# EAGLE design fates-shield-v0.3 (EAGLE 9.6.2)

## Sheet 1 of 2
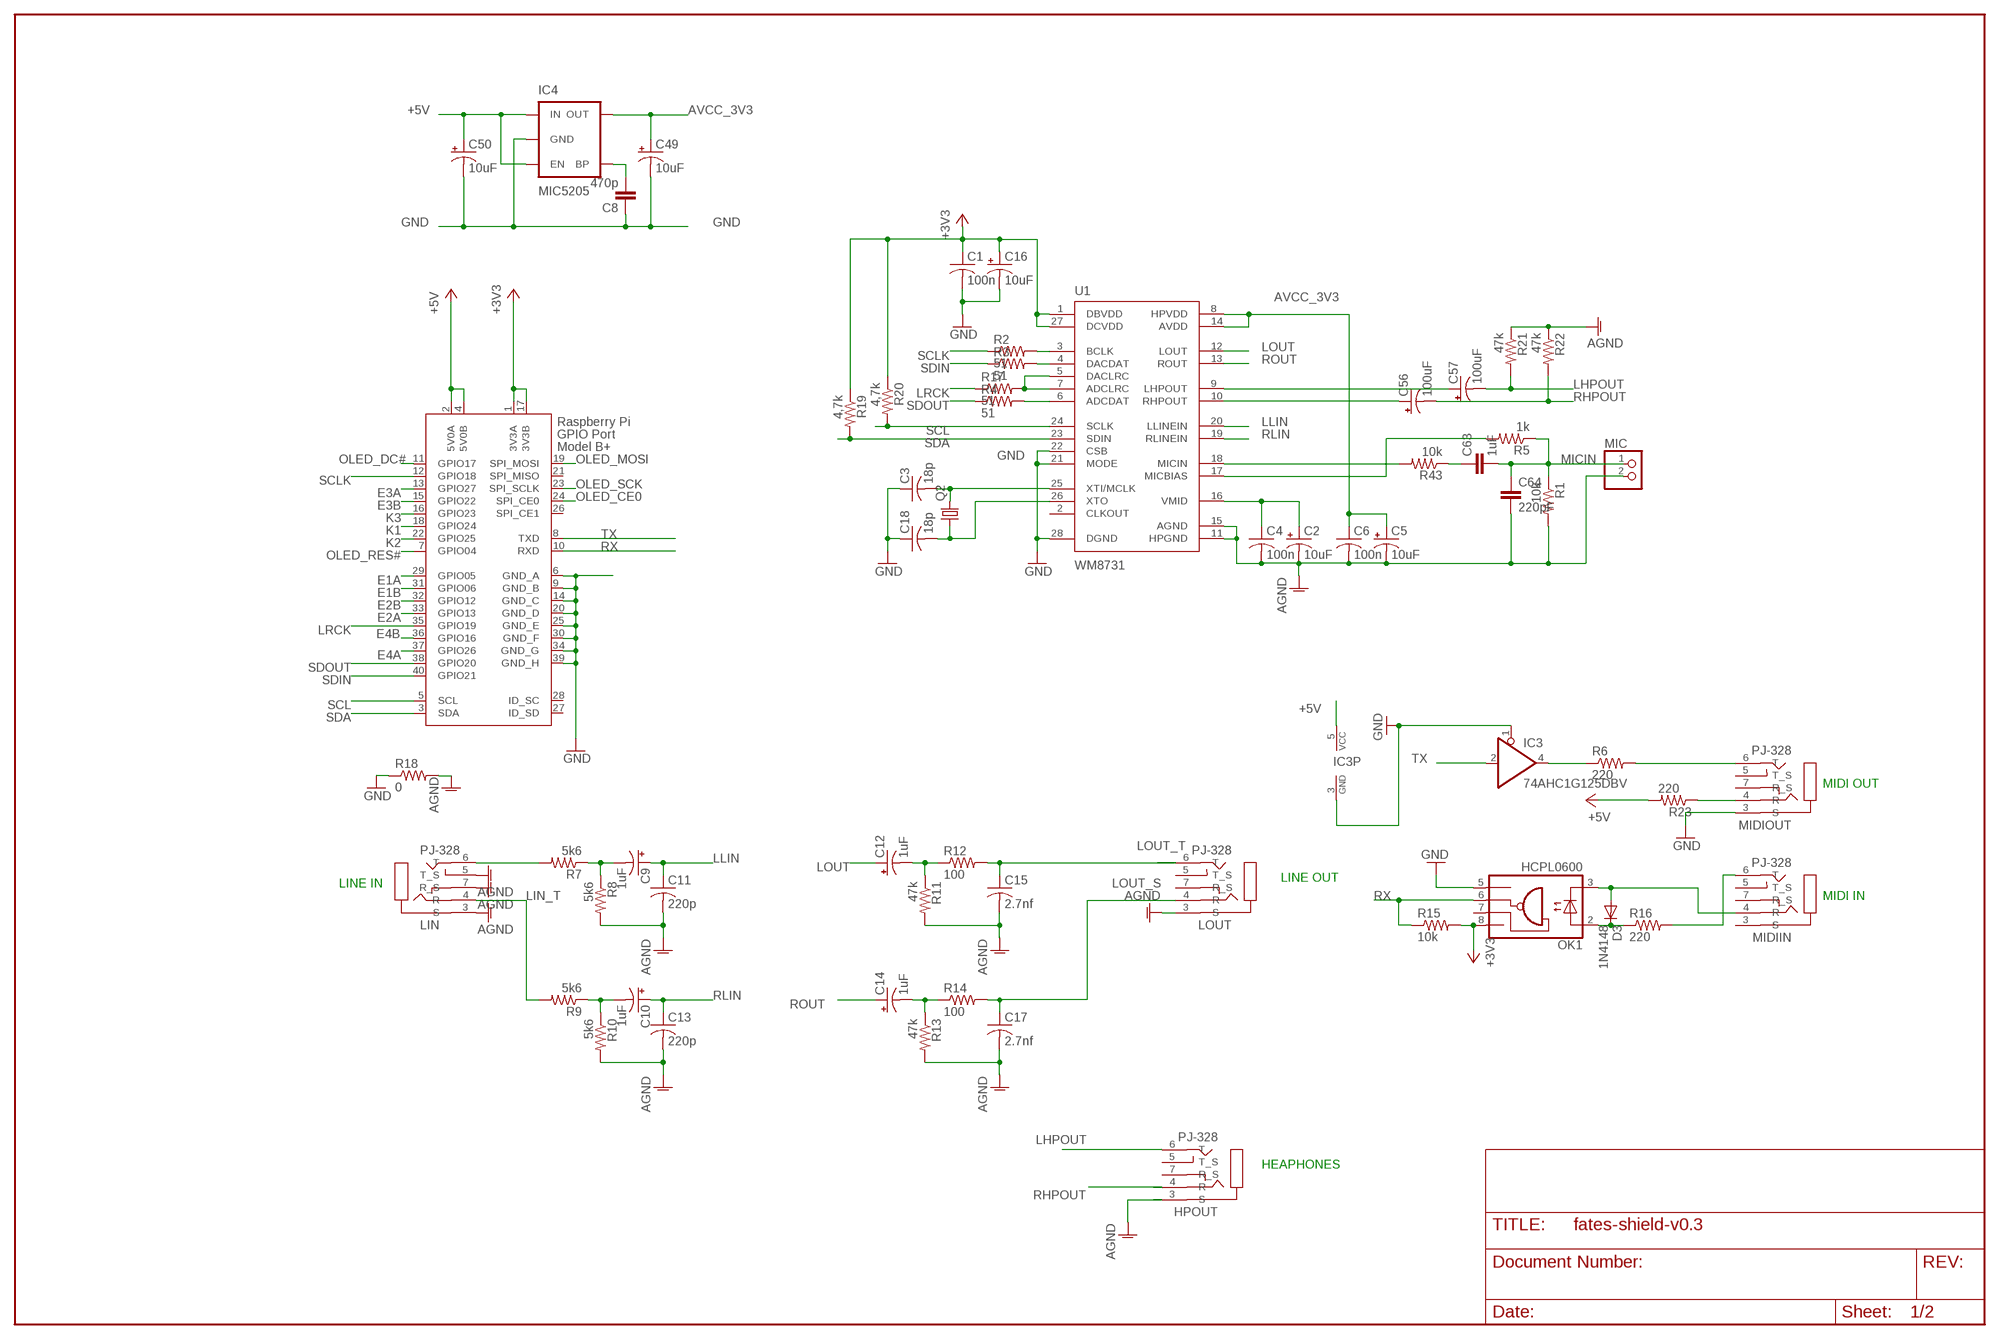
[diagram p0: schematic, sheet 1]

### Parts
C1  100n  C-USC0603  [C0603]
C2  10uF  CAP_POL1206  [EIA3216]
C3  18p  C-USC0603  [C0603]
C4  100n  C-USC0603  [C0603]
C5  10uF  CAP_POL1206  [EIA3216]
C6  100n  C-USC0603  [C0603]
C8  470p  CAP0603-CAP  [0603-CAP]
C9  1uF  CAP_POL1206  [EIA3216]
C10  1uF  CAP_POL1206  [EIA3216]
C11  220p  C-USC0603  [C0603]
C12  1uF  CAP_POL1206  [EIA3216]
C13  220p  C-USC0603  [C0603]
C14  1uF  CAP_POL1206  [EIA3216]
C15  2.7nf  C-USC0603  [C0603]
C16  10uF  CAP_POL1206  [EIA3216]
C17  2.7nf  C-USC0603  [C0603]
C18  18p  C-USC0603  [C0603]
C49  10uF  CAP_POL1206  [EIA3216]
C50  10uF  CAP_POL1206  [EIA3216]
C56  100uF  CAP_POL3528  [EIA3528]
C57  100uF  CAP_POL3528  [EIA3528]
C63  1uF  CAP0603-CAP  [0603-CAP]
C64  220pF  CAP0603-CAP  [0603-CAP]
D3  1N4148  DIODE-SOD323-W  [SOD323-W]
HPOUT  PJ-328  [PJ328]
IC3  74AHC1G125DBV  [DBV_R-PDSO-G5]
IC4  MIC5205  V_REG_LDOSMD  [SPARKFUN-3-2-07_SOT23-5]
LIN  PJ-328  [PJ328]
LOUT  PJ-328  [PJ328]
MIC  PINHD-1X2  [1X02]
MIDIIN  PJ-328  [PJ328]
MIDIOUT  PJ-328  [PJ328]
OK1  HCPL0600  [SOIC08]
Q2  CRYSTALHC49UP  [HC49UP]
R1  10k  RESISTOR0603-RES  [0603-RES]
R2  51  R-US_R0603  [R0603]
R3  51  R-US_R0603  [R0603]
R4  51  R-US_R0603  [R0603]
R5  1k  RESISTOR0603-RES  [0603-RES]
R6  220  R-US_R0603  [R0603]
R7  5k6  R-US_R0603  [R0603]
R8  5k6  R-US_R0603  [R0603]
R9  5k6  R-US_R0603  [R0603]
R10  5k6  R-US_R0603  [R0603]
R11  47k  R-US_R0603  [R0603]
R12  100  R-US_R0603  [R0603]
R13  47k  R-US_R0603  [R0603]
R14  100  R-US_R0603  [R0603]
R15  10k  R-US_R0603  [R0603]
R16  220  R-US_R0603  [R0603]
R17  51  R-US_R0603  [R0603]
R18  0  R-US_R0603  [R0603]
R19  4,7k  RESISTOR0603-RES  [0603-RES]
R20  4,7k  RESISTOR0603-RES  [0603-RES]
R21  47k  RESISTOR0603-RES  [0603-RES]
R22  47k  RESISTOR0603-RES  [0603-RES]
R23  220  R-US_R0603  [R0603]
R43  10k  RESISTOR0603-RES  [0603-RES]
U1  WM8731  [SSOP28]
X1  RASPI_BOARD_B+#_E3  [RASPI_BOARD_B+_EDGES_3DRILL]

### Nets
+3V3: C1.1 C16.A(+) OK1.8(VCC) R15.2 R19.1 R20.1 U1.1(DBVDD) U1.27(DCVDD) X1.1(3V3A) X1.17(3V3B) ; also sheet 2
+5V: C50.A(+) IC3.5(VCC) IC4.1(IN) IC4.3(EN) R23.2 X1.2(5V0A) X1.4(5V0B)
ADCDAT: R4.2 U1.6(ADCDAT)
ADCLRC: R17.2 U1.5(DACLRC) U1.7(ADCLRC)
AGND: C2.C(-) C4.2 C5.C(-) C6.2 C11.2 C13.2 C15.2 C17.2 C64.2 HPOUT.3(S) LIN.3(S) LIN.5(T_S) LIN.7(R_S) LOUT.3(S) MIC.2 R1.2 R8.2 R10.2 R11.2 R13.2 R18.2 R21.1 R22.1 U1.11(HPGND) U1.15(AGND)
AVCC_3V3 [power]: C5.A(+) C6.1 C49.A(+) IC4.5(OUT) U1.8(HPVDD) U1.14(AVDD)
BCLK: R2.2 U1.3(BCLK)
DACDAT: R3.2 U1.4(DACDAT)
E1A: X1.29(GPIO05) ; also sheet 2
E1B: X1.31(GPIO06) ; also sheet 2
E2A: X1.33(GPIO13) ; also sheet 2
E2B: X1.32(GPIO12) ; also sheet 2
E3A: X1.13(GPIO27) ; also sheet 2
E3B: X1.15(GPIO22) ; also sheet 2
E4A: X1.37(GPIO26) ; also sheet 2
E4B: X1.36(GPIO16) ; also sheet 2
GND: C1.2 C3.1 C8.1 C16.C(-) C18.1 C49.C(-) C50.C(-) IC3.1(OE) IC3.3(GND) IC4.2(GND) MIDIOUT.3(S) OK1.5(GND) R18.1 U1.21(MODE) U1.22(CSB) U1.28(DGND) X1.6(GND_A) X1.9(GND_B) X1.14(GND_C) X1.20(GND_D) X1.25(GND_E) X1.30(GND_F) X1.34(GND_G) X1.39(GND_H) ; also sheet 2
K1: X1.18(GPIO24) ; also sheet 2
K2: X1.22(GPIO25) ; also sheet 2
K3: X1.16(GPIO23) ; also sheet 2
L_HPOUT: C57.A(+) U1.9(LHPOUT)
LHPOUT: C57.C(-) HPOUT.6(T) R21.2
LIN_T: LIN.4(R) R9.2
LLIN: C9.A(+) C11.1 U1.20(LLINEIN)
LOUT: C12.A(+) U1.12(LOUT)
LOUT_S: C17.1 LOUT.4(R) R14.2
LOUT_T: C15.1 LOUT.6(T) R12.2
LRCK: R17.1 X1.35(GPIO19)
MIC_BIAS: R5.2 U1.17(MICBIAS)
MIC_IN: R43.2 U1.18(MICIN)
MICIN: C63.2 C64.1 MIC.1 R1.1 R5.1
N$2: MIDIOUT.4(R) R23.1
N$3: IC3.4(O) R6.1
N$4: C2.A(+) C4.1 U1.16(VMID)
N$9: C9.C(-) R7.1 R8.1
N$10: C10.C(-) R9.1 R10.1
N$13: C14.C(-) R13.1 R14.1
N$14: C12.C(-) R11.1 R12.1
N$16: LIN.6(T) R7.2
N$20: D3.A MIDIIN.4(R) OK1.3(C)
N$21: D3.C OK1.2(A) R16.1
N$23: MIDIIN.6(T) R16.2
N$24: MIDIOUT.6(T) R6.2
N$38: C8.2 IC4.4(BP)
N$54: C63.1 R43.1
OLED_CE0: X1.24(SPI_CE0) ; also sheet 2
OLED_DC#: X1.11(GPIO17) ; also sheet 2
OLED_MOSI: X1.19(SPI_MOSI) ; also sheet 2
OLED_RES#: X1.7(GPIO04) ; also sheet 2
OLED_SCK: X1.23(SPI_SCLK) ; also sheet 2
R_HPOUT: C56.A(+) U1.10(RHPOUT)
RHPOUT: C56.C(-) HPOUT.4(R) R22.2
RLIN: C10.A(+) C13.1 U1.19(RLINEIN)
ROUT: C14.A(+) U1.13(ROUT)
RX: OK1.6(VO) R15.1 X1.10(RXD)
SCL: R20.2 U1.24(SCLK) X1.5(SCL)
SCLK: R2.1 X1.12(GPIO18)
SDA: R19.2 U1.23(SDIN) X1.3(SDA)
SDIN: R3.1 X1.40(GPIO21)
SDOUT: R4.1 X1.38(GPIO20)
TX: IC3.2(I) X1.8(TXD)
XTI: C3.2 Q2.2 U1.25(XTI/MCLK)
XTO: C18.2 Q2.1 U1.26(XTO)
Unconnected: HPOUT.5(T_S) HPOUT.7(R_S) LOUT.5(T_S) LOUT.7(R_S) MIDIIN.3(S) MIDIIN.5(T_S) MIDIIN.7(R_S) MIDIOUT.5(T_S) MIDIOUT.7(R_S) OK1.7(VE) U1.2(CLKOUT) X1.21(SPI_MISO) X1.26(SPI_CE1) X1.27(ID_SD) X1.28(ID_SC)

### Notes on the sheet
- MIDI OUT
- LINE OUT
- LINE IN
- MIDI IN
- HEAPHONES

## Sheet 2 of 2
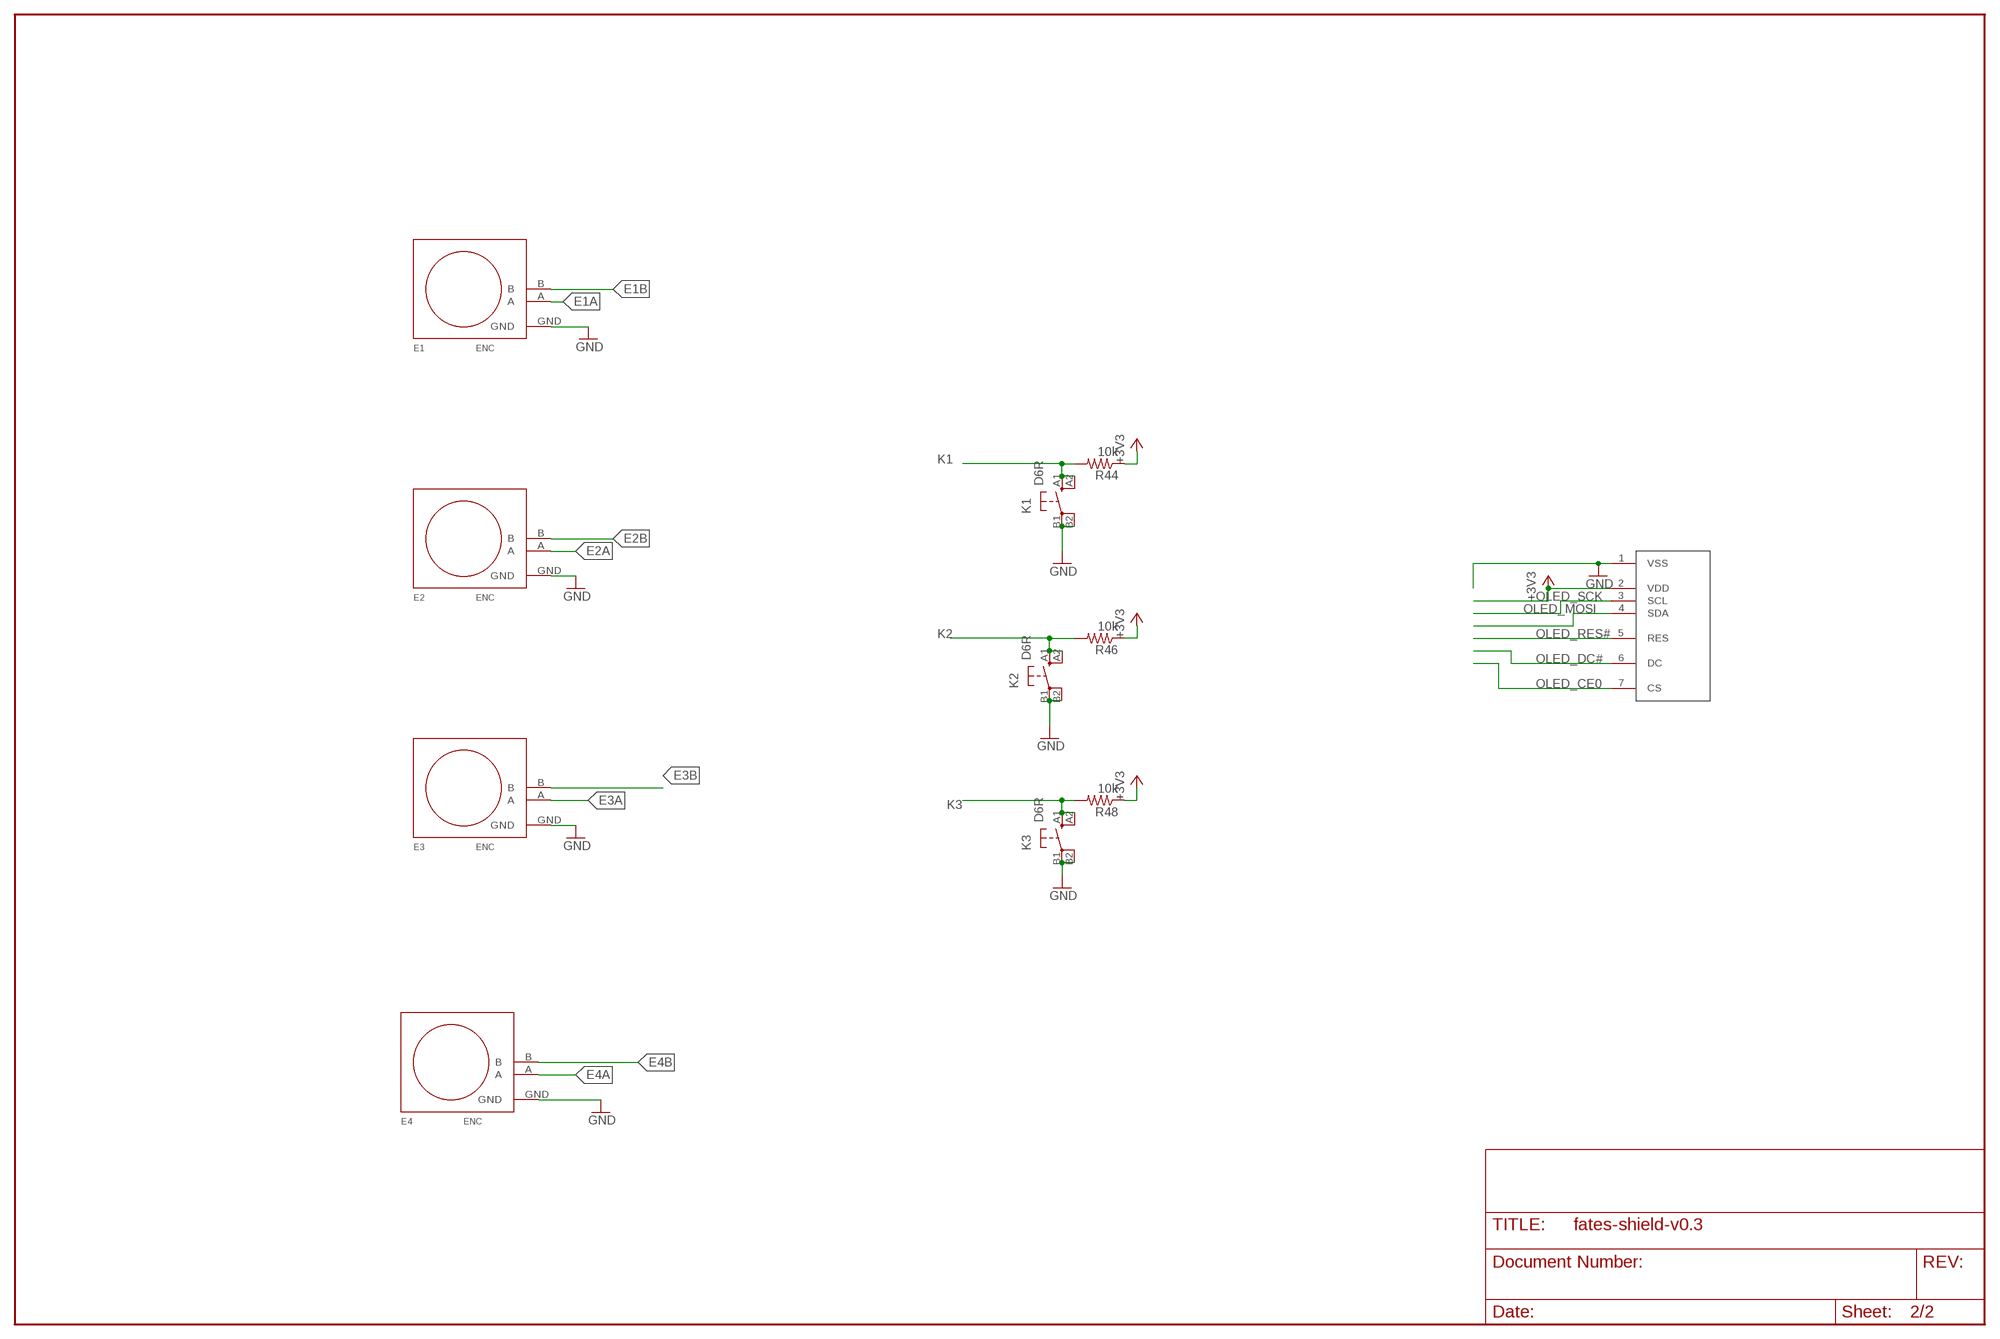
[diagram p1: schematic, sheet 2]

### Parts
E1  ENC  [PEC11RN]
E2  ENC  [PEC11RN]
E3  ENC  [PEC11RN]
E4  ENC  [PEC11RN]
K1  D6R  [D6R]
K2  D6R  [D6R]
K3  D6R  [D6R]
R44  10k  R-US_R0603  [R0603]
R46  10k  R-US_R0603  [R0603]
R48  10k  R-US_R0603  [R0603]
U$2  OLED128X64SSD1325  [OLED-SSD1325]

### Nets
+3V3: R44.1 R46.1 R48.1 U$2.2(VDD) ; also sheet 1
E1A: E1.A ; also sheet 1
E1B: E1.B ; also sheet 1
E2A: E2.A ; also sheet 1
E2B: E2.B ; also sheet 1
E3A: E3.A ; also sheet 1
E3B: E3.B ; also sheet 1
E4A: E4.A ; also sheet 1
E4B: E4.B ; also sheet 1
GND: E1.GND E2.GND E3.GND E4.GND K1.B1(P) K1.B2(P1) K2.B1(P) K2.B2(P1) K3.B1(P) K3.B2(P1) U$2.1(VSS) ; also sheet 1
K1: K1.A1(S) K1.A2(S1) R44.2 ; also sheet 1
K2: K2.A1(S) K2.A2(S1) R46.2 ; also sheet 1
K3: K3.A1(S) K3.A2(S1) R48.2 ; also sheet 1
OLED_CE0: U$2.7(CS) ; also sheet 1
OLED_DC#: U$2.6(DC) ; also sheet 1
OLED_MOSI: U$2.4(SDA) ; also sheet 1
OLED_RES#: U$2.5(RES) ; also sheet 1
OLED_SCK: U$2.3(SCL) ; also sheet 1

## Library data of the parts
C1 C3 C4 C6 C11 C13 C15 C17 C18 = rcl:C-US: CAPACITOR, American symbol
C2 C5 C9 C10 C12 C14 C16 C49 C50 = osborn:CAP_POL: Capacitor Polarized These are standard SMD and PTH capacitors. Normally 10uF, 47uF, and 100uF in electrolytic and tantalum varieties. Always verify the external diameter of the through hole cap, it varies with capacity, voltage, and manufacturer. The EIA devices should be standard.; CID: 340
C8 = osborn:CAP: Capacitor Standard 0603 ceramic capacitor, and 0.1" leaded capacitor.; CID: 111
C56 C57 = SparkFun-20110623:CAP_POL: Capacitor Polarized These are standard SMD and PTH capacitors. Normally 10uF, 47uF, and 100uF in electrolytic and tantalum varieties. Always verify the external diameter of the through hole cap, it varies with capacity, voltage, and manufacturer. The EIA devices should be standard.; CID: 68
C63 = osborn:CAP: Capacitor Standard 0603 ceramic capacitor, and 0.1" leaded capacitor.; CID: 73
C64 = osborn:CAP: Capacitor Standard 0603 ceramic capacitor, and 0.1" leaded capacitor.; CID: 345
D3 = diode:DIODE-: DIODE
E1-E4 = lines:ENC
HPOUT LIN LOUT MIDIIN MIDIOUT = PJ-328:PJ-328: 2.5/3.5 Phone jack series Source: Datasheet <http://www.intechswitch.com/products/2535Phonejackseries2535chazuoxilie/202.html>; DESCRIPTION: 2.5/3.5 Phone jack series; HEIGHT: 5mm; MANUFACTURER_NAME: Intech Electronic Technology; MANUFACTURER_PART_NUMBER: PJ-328
IC3 = 74xx-little-de:74*1G125: Single Bus Buffer Gate with 3-State Output
IC4 = osborn:V_REG_LDO: Voltage Regulator LDO Standard 150mA LDO voltage regulator in SOT-23 layout. Micrel part MIC5205. BP (by-pass) pin is used to lower output noise with 470pF cap.; CID: 146
K1-K3 = og-switch:D6R: C&K D6R
MIC = pinhead:PINHD-1X2: PIN HEADER
OK1 = HCPL0600:HCPL0600: HEWLETT PACKARD OPTO COUPLER Check prices <https://pricing.snapeda.com/parts/HCPL0600/ON%20Semiconductor/view-part?ref=eda>; AVAILABILITY: In Stock; DESCRIPTION: Logic Output Optoisolator 10Mbps Open Collector 3750Vrms 1 Channel 5kV/µs CMTI 8-SOIC; MF: ON Semiconductor; MP: HCPL0600; PACKAGE: SOIC-8 ON Semiconductor; PRICE: None; PURCHASE-URL: https://pricing.snapeda.com/search/part/HCPL0600/?ref=eda
Q2 = crystal:CRYSTAL: CRYSTAL
R1 R43 = osborn:RESISTOR: Resistor Basic schematic elements and footprints for 0603, 1206, and PTH resistors.; CID: 69; SUPPLIER: none
R2-R4 R6-R18 R23 R44 R46 R48 = rcl:R-US_: RESISTOR, American symbol
R5 = osborn:RESISTOR: Resistor Basic schematic elements and footprints for 0603, 1206, and PTH resistors.; CID: 102; SUPPLIER: none
R19-R22 = osborn:RESISTOR: Resistor Basic schematic elements and footprints for 0603, 1206, and PTH resistors.; CID: 236; SUPPLIER: none
U1 = og-dac:WM8731
U$2 = oled-modules:OLED128X64: SSD1325 7-pin SPi OLED
X1 = raspberrypi_bastelstube_v13:RASPI_BOARD_B+#: Raspberry Pi GPIO connector with markings for the outer dimensions of the Raspberry Pi board model B+ with different sets of drill holes or mounting pads All pins connected

## Net classes
1 power: width 0.508 mm

## Board
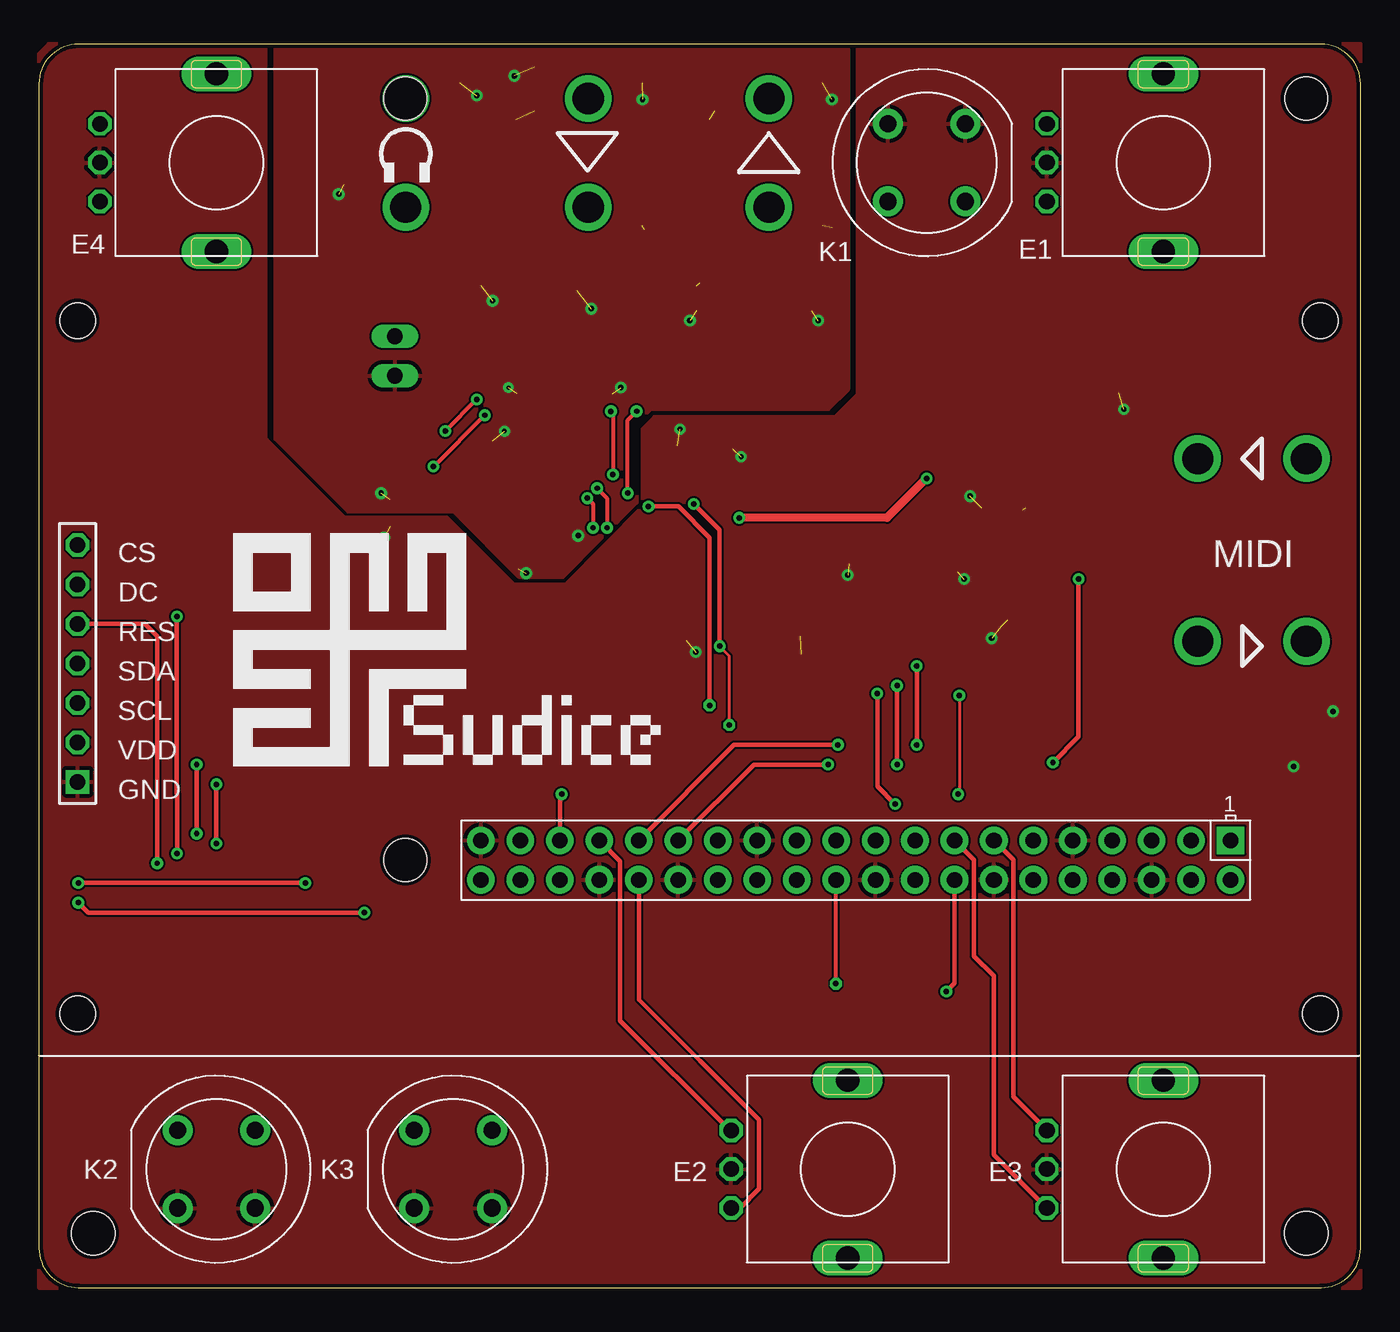
[diagram p2: board, top side]
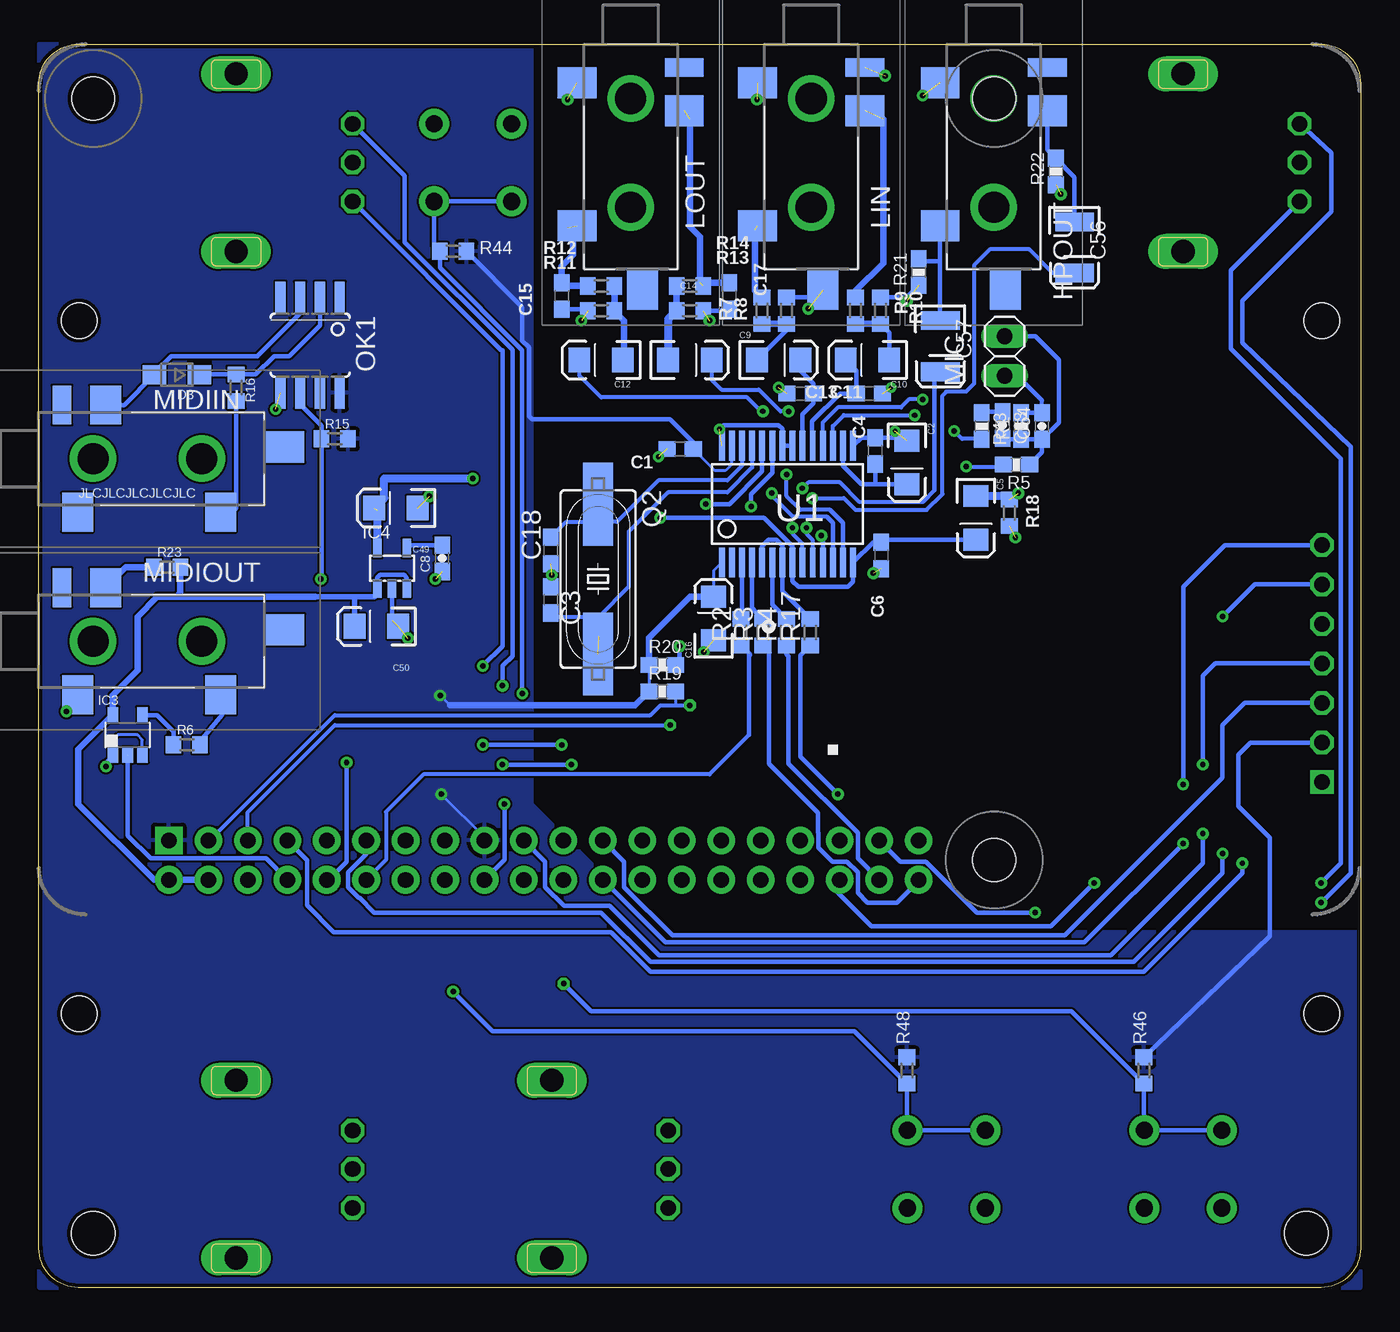
[diagram p3: board, bottom side, seen from below]

Size 85.09 x 80.01 mm. Coordinates in mm from the lower left corner, seen from the top.
Outline: 0,77.47 0,2.54 arc90 2.54,0 82.55,0 arc90 85.09,2.54 85.09,77.47 arc90 82.55,80.01 2.54,80.01 arc90 0,77.47
Copper layers (1*16): Top 0.035mm / dielectric 1.5mm / Bottom 0.035mm
Design rules "default *": minimum track width 8mil, minimum drill 10mil, track to track 5mil, track to pad 5mil, pad to pad 5mil, via to via 5mil, smd to smd 0mil, copper to edge 10mil, drill to drill 8mil, minimum pad ring 10mil, minimum via ring 8mil, stop-mask expansion 4mil, vias tented up to drill 0mil, thermal gap 10mil
Holes 2.8 mm at 81.6,3.49 3.49,3.49

### Footprints (pad centres in the part's own frame; a part is rotated, then mirrored left to right if it is on the bottom)
C0603 = smd 1.1 x 1: 1 -0.85,0; 2 0.85,0
EIA3216 = smd 1.4 x 1.6: A 1.4,0; C -1.4,0
0603-CAP = smd 1.1 x 1: 1 -0.85,0; 2 0.85,0
EIA3528 = smd 1.2 x 2.5: A 1.65,0; C -1.65,0
SOD323-W = smd 1.5 x 1.2: A 1.45,0; C -1.45,0
PEC11RN = drill 1 octagon: A -2.5,-7.5; B 2.5,-7.5; GND 0,-7.5 | drill 1.5 long: P$1 -5.715,0; P$2 5.715,0
PJ328 = smd 2 x 2.5: 3 -4.175,-3.45; 4 -2.375,3.45; 6 5.025,-3.45 | smd 2.5 x 2: 5 9.175,0.75 | smd 1.2 x 2.5: 7 -5.175,3.45 | drill 2 pad 3: MH1 -3.175,0; MH2 3.825,0
DBV_R-PDSO-G5 = smd 0.69 x 0.99: 1 -0.95,-1.29; 2 0,-1.29; 3 0.95,-1.29; 4 0.95,1.3; 5 -0.95,1.3
SPARKFUN-3-2-07_SOT23-5 = smd 0.55 x 1.2: 1 -0.95,-1.3; 2 0,-1.3; 3 0.95,-1.3; 4 0.95,1.3; 5 -0.95,1.3
D6R = drill 1.1 pad 1.93: A1 -2.5,2.5; A2 2.5,2.5; B1 -2.5,-2.5; B2 2.5,-2.5
1X02 = drill 1.016 long: 1 -1.27,0; 2 1.27,0
SOIC08 = smd 0.66 x 2.032: 1 -1.905,-3.073; 2 -0.635,-3.073; 3 0.635,-3.073; 4 1.905,-3.073; 5 1.905,3.073; 6 0.635,3.073; 7 -0.635,3.073; 8 -1.905,3.073
HC49UP = smd 5.334 x 1.93: 1 -4.826,0; 2 4.826,0
0603-RES = smd 1.1 x 1: 1 -0.85,0; 2 0.85,0
R0603 = smd 1 x 1.1: 1 -0.85,0; 2 0.85,0
SSOP28 = smd 0.381 x 1.905: 1 -4.55,-3.752; 2 -3.9,-3.752; 3 -3.25,-3.752; 4 -2.6,-3.752; 5 -1.95,-3.752; 6 -1.3,-3.752; 7 -0.65,-3.752; 8 0,-3.752; 9 0.65,-3.752; 10 1.3,-3.752; 11 1.95,-3.752; 12 2.6,-3.752; 13 3.25,-3.752; 14 3.9,-3.752; 15 3.9,3.752; 16 3.25,3.752; 17 2.6,3.752; 18 1.95,3.752; 19 1.3,3.752; 20 0.65,3.752; 21 0,3.752; 22 -0.65,3.752; 23 -1.3,3.752; 24 -1.95,3.752; 25 -2.6,3.752; 26 -3.25,3.752; 27 -3.9,3.752; 28 -4.55,3.752
OLED-SSD1325 = drill 1 pad 1.5 square: 1 2.499,17.62 | drill 1 pad 1.5 octagon: 2 2.499,20.16; 3 2.499,22.7; 4 2.499,25.24; 5 2.499,27.78; 6 2.499,30.32; 7 2.499,32.86 | hole 2.286: 82.5,2.7; 2.5,2.7; 82.5,47.3; 2.5,47.3
RASPI_BOARD_B+_EDGES_3DRILL = drill 1 pad 1.778 square: 1 8.37,51.23 | drill 1 pad 1.778: 2 8.37,53.77; 3 10.91,51.23; 4 10.91,53.77; 5 13.45,51.23; 6 13.45,53.77; 7 15.99,51.23; 8 15.99,53.77; 9 18.53,51.23; 10 18.53,53.77; 11 21.07,51.23; 12 21.07,53.77; 13 23.61,51.23; 14 23.61,53.77; 15 26.15,51.23; 16 26.15,53.77; 17 28.69,51.23; 18 28.69,53.77; 19 31.23,51.23; 20 31.23,53.77; 21 33.77,51.23; 22 33.77,53.77; 23 36.31,51.23; 24 36.31,53.77; 25 38.85,51.23; 26 38.85,53.77; 27 41.39,51.23; 28 41.39,53.77; 29 43.93,51.23; 30 43.93,53.77; 31 46.47,51.23; 32 46.47,53.77; 33 49.01,51.23; 34 49.01,53.77; 35 51.55,51.23; 36 51.55,53.77; 37 54.09,51.23; 38 54.09,53.77; 39 56.63,51.23; 40 56.63,53.77 | hole 2.75: 3.5,3.5; 61.5,3.5; 61.5,52.5

### Placement (x,y rotation side)
C1  43.81,53.97 180 bottom
C2  29.21,53.09 270 bottom
C3  52.13,44.26 270 bottom
C4  31.24,53.85 90 bottom
C5  24.77,49.53 270 bottom
C6  30.86,47.12 270 bottom
C8  59.12,46.93 90 bottom
C9  37.47,59.69 0 bottom
C10  31.75,59.69 180 bottom
C11  36.07,57.53 180 bottom
C12  48.9,59.69 180 bottom
C13  31.62,57.53 0 bottom
C14  43.18,59.69 0 bottom
C15  51.44,63.82 270 bottom
C16  41.66,43.05 90 bottom
C17  40.64,63.82 270 bottom
C18  52.13,47.43 90 bottom
C49  62.1,50.16 180 bottom
C50  63.37,42.55 180 bottom
C56  18.41,66.93 270 bottom
C57  27.05,60.58 270 bottom
C63  23.05,55.5 270 bottom
C64  20.51,55.44 90 bottom
D3  76.2,58.74 180 bottom
E1  72.39,72.39 270 top
E2  52.07,7.62 270 top
E3  72.39,7.62 270 top
E4  11.43,72.39 270 top
HPOUT  23.62,73.34 270 bottom
IC3  79.38,35.56 0 bottom
IC4  62.36,46.29 0 bottom
K1  57.15,72.39 180 top
K2  11.43,7.62 0 top
K3  26.67,7.62 0 top
LIN  35.37,73.34 270 bottom
LOUT  46.99,73.34 270 bottom
MIC  22.92,59.94 270 bottom
MIDIIN  78.42,53.34 0 bottom
MIDIOUT  78.42,41.59 0 bottom
OK1  67.63,60.64 180 bottom
Q2  49.09,45.59 270 bottom
R1  21.84,55.44 90 bottom
R2  39.88,42.16 90 bottom
R3  38.48,42.16 90 bottom
R4  36.96,42.16 90 bottom
R5  22.16,52.96 180 bottom
R6  75.56,34.92 0 bottom
R7  38.54,62.86 90 bottom
R8  36.96,62.86 90 bottom
R9  32.51,62.86 90 bottom
R10  30.92,62.86 90 bottom
R11  48.9,62.86 180 bottom
R12  48.9,64.45 180 bottom
R13  43.18,62.86 0 bottom
R14  43.18,64.45 0 bottom
R15  66.04,54.61 0 bottom
R16  72.39,57.91 270 bottom
R17  35.43,42.16 90 bottom
R18  22.61,49.85 90 bottom
R19  44.96,38.35 0 bottom
R20  44.96,40.07 0 bottom
R21  28.45,65.34 90 bottom
R22  19.62,71.82 90 bottom
R23  76.83,46.36 0 bottom
R43  24.38,55.44 270 bottom
R44  58.42,66.67 180 bottom
R46  13.97,13.97 270 bottom
R48  29.21,13.97 270 bottom
U1  36.58,50.42 0 bottom
U$2  0,14.92 0 top
X1  85.09,80.01 180 top

### Tracks (layer width: path | path; a pad name or v marks a point on that pad's centre or on a via)
+3V3  (via drill 0.35)
  Top 0.203: v59.25,38.1 59.25,31.82 v59.18,31.75
  Bottom 0.203: U1.27 40.51,54.13 40.51,52.96 40.89,52.58 41.57,52.58 C1.1 | U1.1 41.66,46.14 C16.A | R20.1 45.81,40 R19.1 | 58.61,37.47 59,37.86 59,38.05 59.05,38.1 v59.25,38.1 | v59.18,31.75 56.4,28.97 X1.17
  Bottom 0.305: R46.1 5.84,22.61 5.84,28.96 7.87,30.99 7.87,34.29 7.11,35.05 2.53,35.05 U$2.2 | C1.1 42.97,54.39 44.45,55.88 53.34,55.88 53.54,56.08 53.54,60.5 53.98,60.94 53.98,63.08 R44.1
  Bottom 0.406: R19.1 46.7,37.47 58.61,37.47 | C16.A 43.18,44.45 45.81,41.82 45.81,40
  pour Bottom: 0,22.86 45.09,22.86 53.34,31.11 53.34,80.01 85.09,80.01 85.09,0 0,0
+5V
  Bottom 0.305: IC4.3 61.41,45.69 61.59,45.87 63.13,45.87 63.31,45.69 IC4.1
  Bottom 0.356: 64.77,44.45 63.5,44.45 63.31,44.64 IC4.1 | C50.A 64.77,44.45 | 67.31,44.45 64.77,44.45
  Bottom 0.406: X1.4 X1.2 77.67,26.24 82.55,31.11 82.55,34.63 IC3.5 80.33,38.13 78.74,39.72 78.74,43.18 77.47,44.45 76.2,44.45 | 76.2,44.45 67.31,44.45 | R23.2 75.98,44.66 76.2,44.45
ADCDAT
  Bottom 0.305: U1.6 37.88,43.93 R4.2
ADCLRC
  Bottom 0.305: R17.2 37.23,44.81 U1.7 37.23,47.74 37.61,48.12 38.12,48.12 38.53,47.71 U1.5
AGND  (via drill 0.25 pad 0.38, 0.3, 0.35, 0.35 pad 0.38)  (14 unrouted)
  Top 0.254: 22.1,58.67 MIC.2
  Bottom 0.254: C64.2 20.51,57.09
  Bottom 0.305: C64.2 R1.2 | R8.2 35.07,63.72 LIN.5 | R13.2 40.74,62.86 C17.2 | C15.2 49.85,62.97 R11.2 | R10.2 29.22,63.72 R21.1 | C2.C 29.42,54.7 C4.2 32.15,54.7 U1.15 | U1.11 34.63,48.3 v34.71,48.39 | 20.51,57.09 22.1,58.67 MIC.2
  Bottom 0.508: R18.2 22.84,50.93 C5.C
  other vias: 30.61,77.98 38.86,76.45 51.05,76.45 28.19,76.71 19.3,70.36 22.03,51.12 35.56,62.99 50.16,62.23 41.91,62.23 29.21,63.5 30.23,57.91 37.47,57.91 31.37,45.97 29.97,55.12
  pour Top: 52.07,80.01 52.07,57.78 50.8,56.52 39.37,56.52 38.48,55.63 38.48,50.53 33.72,45.72 30.92,45.72 26.73,49.91 19.94,49.91 15.24,54.61 15.24,80.01
AVCC_3V3  (via drill 0.35)  (1 unrouted)
  Top 0.508: v57.15,52.07 54.61,49.53 v45.09,49.53
  Bottom 0.305: C5.A 30.7,48.13 | C6.1 31.38,47.97 U1.14 32.68,45.43 33.02,45.08 36.2,45.08 36.58,45.47 U1.8 36.58,47.7 38.41,49.53 v45.09,49.53
  Bottom 0.508: 63.31,50.02 IC4.5 | C49.A 62.86,50.81 62.86,52.07 v57.15,52.07 | 30.7,48.13 C6.1
BCLK
  Bottom 0.305: U1.3 39.83,43.07 R2.2
DACDAT
  Bottom 0.305: U1.4 39.18,43.76 39.05,43.63 39.05,43.58 R3.2
E1A  (via drill 0.35)
  Top 0.305: X1.29 46.03,33.66 v50.8,33.66 | v55.24,33.66 v55.24,38.73
  Bottom 0.305: E1.A 61.53,71.53 61.53,67.27 54.61,60.35 54.61,40.64 55.24,40 v55.24,38.73 | v50.8,33.66 v55.24,33.66
E1B  (via drill 0.35)
  Top 0.305: X1.31 44.77,34.92 v51.44,34.92 | v56.52,34.92 v56.52,40
  Bottom 0.305: E1.B 55.33,60.33 55.24,60.33 55.24,41.27 v56.52,40 | v51.44,34.92 v56.52,34.92
E2A
  Top 0.305: X1.33 37.43,27.43 37.43,17.18 44.49,10.12 E2.A
E2B
  Top 0.254: 38.62,18.53 42.55,14.6
  Top 0.305: X1.32 38.62,18.53 | 42.55,14.6 46.35,10.79 46.35,6.35 45.12,5.12 E2.B
E3A
  Top 0.305: X1.13 62.74,27.52 62.74,12.27 E3.A
E3B
  Top 0.305: X1.15 60.2,27.52 60.2,21.34 61.47,20.07 61.47,8.54 E3.B
E4A  (via drill 0.35)
  Top 0.305: v2.54,24.77 3.17,24.13 v20.95,24.13
  Bottom 0.305: v2.54,24.77 0.64,26.67 0.64,54.12 7.62,60.79 7.62,63.5 1.91,69.22 1.91,73.03 E4.A | v20.95,24.13 24.7,24.13 27.98,27.41 29.63,27.41 X1.37
E4B  (via drill 0.35)
  Top 0.305: v2.54,26.04 v17.14,26.04
  Bottom 0.305: E4.B 8.36,65.47 8.36,60.42 1.27,53.34 1.27,27.3 v2.54,26.04 | v17.14,26.04 19.94,23.24 31.5,23.24 33.66,25.4 33.66,26.12 X1.36
GND  (via drill 0.3, 0.35, 0.35 pad 0.38)  (10 unrouted)
  Bottom 0.203: C18.1 C3.1 | IC3.3 78.42,35.24 78.74,35.56 80.01,35.56 80.39,35.18 80.39,34.29 80.34,34.29 IC3.1 80.77,33.82 v80.77,33.53
  Bottom 0.305: IC4.2 62.36,42.93 | U1.21 U1.22 37.23,55.26 37.47,55.5 41.02,55.5 v41.27,55.24 | MIDIOUT.3 83.31,37.43 v83.31,37.08
  other vias: 22.23,48.26 59.56,45.59 61.34,41.78 69.85,56.52 59.94,50.93 52.07,45.85 42.29,40.89 45.21,53.47
  pour Top: 85.09,0 85.09,80.01 52.7,80.01 52.7,57.47 51.24,56.01 39.62,56.01 38.86,55.24 38.86,50.26 33.91,45.21 30.61,45.21 26.29,49.53 19.68,49.53 14.61,54.61 14.61,80.01 0.64,80.01 0,79.38 0,0
K1  (via drill 0.35)
  Top 0.305: v55.12,31.11 53.98,32.26 v53.98,38.23
  Bottom 0.305: K1.A2 K1.A1 59.65,67.05 R44.2 59.27,65.62 53.98,60.33 v53.98,38.23 | v55.12,31.11 55.12,27.52 X1.18
K2  (via drill 0.35)
  Top 0.254: v51.31,19.56 51.31,26.23 X1.22
  Bottom 0.305: K2.A1 K2.A2 13.97,10.16 R46.2 18.63,17.78 49.53,17.78 v51.31,19.56
K3  (via drill 0.35)
  Top 0.305: X1.16 58.94,19.57 v58.42,19.05
  Bottom 0.305: K3.A1 K3.A2 29.21,10.16 R48.2 32.6,16.51 55.88,16.51 v58.42,19.05
L_HPOUT  (via drill 0.35, 0.35 pad 0.38)
  Top 0.254: v35.94,51.44 36.58,50.8 v36.58,48.89
  Bottom 0.254: U1.9 35.93,47.86 36.58,48.51 v36.58,48.89 | v35.94,51.44 35.56,51.82 33.53,51.82 32.26,50.55 28.19,50.55 27.43,51.31
  Bottom 0.305: C57.A 27.43,58.55 27.43,51.31
LHPOUT
  Bottom 0.305: HPOUT.6 27.07,66.04 | 27.07,66.04 27.07,62.25 C57.C | R21.2 28.3,66.04 27.07,66.04
LIN_T  (1 unrouted)
  Bottom 0.406: R9.2 32.51,64.14 30.73,65.91 30.73,75.18
LLIN
  Bottom 0.305: C9.A 36.06,59.01 35.22,58.17 C11.1 35.22,56.9 35.93,56.19 U1.20
LOUT  (via drill 0.35, 0.35 pad 0.38)
  Top 0.254: v37.91,51.12 37.91,55.82 v38.48,56.39
  Bottom 0.254: 34.37,49.61 36.53,49.61 37.46,50.54 37.97,51.05 v37.91,51.12 | v38.48,56.39 38.61,56.39 39.5,57.28 48.9,57.28 50.3,58.68 C12.A
  Bottom 0.305: U1.12 33.98,49.22 34.37,49.61
LOUT_S  (2 unrouted)
  Bottom 0.406: 42.55,64.67 42.55,67.63 43.18,68.26 43.18,75.18 | C17.1 42.12,64.67 R14.2
LOUT_T  (1 unrouted)
  Bottom 0.406: R12.2 51.22,64.45 C15.1 51.44,65.72 50.69,66.47 50.69,67.83 51.05,68.2
LRCK  (via drill 0.35)
  Top 0.305: X1.35 33.54,31.63 v33.66,31.75
  Bottom 0.305: v33.66,31.75 36.07,34.16 36.07,40.68 R17.1
MIC_BIAS  (via drill 0.35)
  Top 0.254: v28.7,56.13 v25.4,52.83
  Bottom 0.254: U1.17 33.98,55.43 33.27,56.13 v28.7,56.13 | v25.4,52.83 23.14,52.83 R5.2
MIC_IN  (via drill 0.35)
  Top 0.254: v28.19,57.15 v26.16,55.12
  Bottom 0.254: U1.18 34.63,55.67 33.66,56.64 29.59,56.64 29.08,57.15 v28.19,57.15 | R43.2 24.41,54.61 25.65,54.61 v26.16,55.12
MICIN
  Bottom 0.305: C64.1 R1.1 22.99,54.59 C63.2 | R5.1 20.51,53.76 C64.1 | C64.1 19.43,55.66 19.43,59.69 20.95,61.21 MIC.1
N$2
  Bottom 0.406: R23.1 79.48,46.36 MIDIOUT.4
N$3
  Bottom 0.203: IC3.4 78.39,36.83
  Bottom 0.305: R6.1 76.42,35.77 77.47,36.83 78.39,36.83
N$4
  Bottom 0.305: C2.A 31.24,51.69 | 31.24,51.69 32.13,51.69 33.33,52.88 U1.16 | C4.1 31.24,51.69
N$9
  Bottom 0.305: C9.C 36.96,61.6 R8.1
  Bottom 0.406: R7.1 R8.1
N$10
  Bottom 0.305: C10.C 30.35,61.44 R10.1
  Bottom 0.406: R10.1 R9.1
N$13
  Bottom 0.406: R14.1 R13.1
  Bottom 0.508: R13.1 44.58,62.31 C14.C
N$14
  Bottom 0.203: 47.41,59.79 47.41,59.78 C12.C
  Bottom 0.406: R12.1 R11.1 47.41,62.23 47.41,59.79
N$16  (1 unrouted)
  Bottom 0.406: 38.99,68.07 38.99,64.16 R7.2
N$20
  Bottom 0.305: MIDIIN.4 79.6,56.79 D3.A 77.65,58.88 76.58,59.94 70.99,59.94 71.01,59.96 68.26,62.7 OK1.3
N$21
  Bottom 0.305: OK1.2 66.99,61.91 68.96,59.94 69.94,59.94 71.12,58.76 R16.1 74.72,58.76 D3.C
N$23
  Bottom 0.305: R16.2 72.39,50.16 72.67,49.89 MIDIIN.6
N$24
  Bottom 0.305: R6.2 74.72,35.17 73.28,36.87 73.28,38.03 MIDIOUT.6
N$38
  Bottom 0.305: C8.2 61.22,47.78 IC4.4
N$54
  Bottom 0.305: R43.1 24.32,56.35 C63.1
OLED_CE0  (via drill 0.35)
  Top 0.305: v11.43,32.38 v11.43,28.57
  Bottom 0.305: X1.24 44.77,22.22 17.78,22.22 v11.43,28.57 | v11.43,32.38 11.43,45.08 8.73,47.78 U$2.7
OLED_DC#  (via drill 0.35)
  Top 0.305: v8.89,27.94 8.89,31.75 8.87,31.77 8.87,43.16 v8.89,43.18
  Bottom 0.305: X1.11 64.02,27.89 65.19,26.72 65.19,25.76 64.5,25.07 64.44,25.07 63.5,24.13 48.9,24.13 45.72,20.95 14.61,20.95 8.89,26.67 v8.89,27.94 | v8.89,43.18 6.83,45.24 U$2.6
OLED_MOSI  (via drill 0.35)
  Top 0.305: v10.16,33.66 v10.16,29.21
  Bottom 0.305: X1.19 52.49,27.41 52.49,25.76 51.29,24.56 48.35,24.56 45.17,21.39 16.08,21.39 10.16,27.3 v10.16,29.21 | v10.16,33.66 10.16,39.37 9.37,40.16 U$2.4
OLED_RES#  (via drill 0.35)
  Top 0.305: v7.62,27.3 7.62,41.91 6.83,42.7 U$2.5
  Bottom 0.305: X1.7 67.83,27.51 67.83,24.59 66.1,22.86 48.26,22.86 45.72,20.32 13.97,20.32 7.62,26.67 v7.62,27.3
OLED_SCK
  Bottom 0.305: X1.23 47.41,27.41 47.41,25.76 44.31,22.66 19.05,22.66 8.89,32.82 8.89,36.2 7.46,37.62 U$2.3
R_HPOUT  (via drill 0.35)
  Top 0.254: v35.67,48.89 35.67,50.43 v35.31,50.8
  Bottom 0.254: U1.10 35.29,46.69 35.29,48.13 35.67,48.51 v35.67,48.89 | v35.31,50.8 33.27,50.8 32.51,50.04 27.94,50.04 26.92,51.05 26.92,57.4 26.67,57.66 25.4,57.66 24.89,58.17 24.89,65.79 23.88,66.8 21.34,66.8 19.81,65.28 C56.A
RHPOUT
  Bottom 0.305: HPOUT.4 20.17,73.22 R22.2 18.41,71.46 C56.C
RLIN
  Bottom 0.305: C10.A 32.47,59.01 C13.1 33.53,57.53 35.31,55.75 35.31,54.2 U1.19
ROUT  (via drill 0.35, 0.35 pad 0.38)
  Top 0.254: v36.83,56.39 36.96,56.26 v36.96,52.32
  Bottom 0.254: v36.96,52.32 36.96,50.93 36.07,50.04 34.16,50.04 | C14.A 41.78,58.42 41.15,57.78 38.73,57.78 37.34,56.39 v36.83,56.39
  Bottom 0.305: 34.16,50.04 33.33,49.2 U1.13
RX  (via drill 0.35)
  Top 0.305: v66.93,45.59 66.93,35.43 v65.28,33.78
  Bottom 0.305: X1.10 66.43,26.24 65.28,27.39 v65.28,33.78 | OK1.6 68.26,56.83 66.89,55.46 R15.1 66.89,45.63 v66.93,45.59
SCL  (via drill 0.35, 0.35 pad 0.38)
  Top 0.203: v44.45,36.2 44.45,40.64 43.81,41.27
  Top 0.305: v42.16,50.42 43.81,48.77 43.81,41.27 v43.84,41.27
  Bottom 0.254: X1.5 71.64,30.59 66.04,36.2 v44.45,36.2
  Bottom 0.305: U1.24 38.53,52.53 40.64,50.42 v42.16,50.42 | v43.84,41.27 43.84,40.07 R20.2
SCLK
  Bottom 0.254: 39.37,35.56 41.91,33.02 60.33,33.02 62.74,30.61 62.74,27.52 X1.12
  Bottom 0.305: R2.1 39.31,40.75 39.31,40.7 39.37,40.76 39.37,35.56
SDA  (via drill 0.35, 0.35 pad 0.38)
  Top 0.305: v39.24,50.27 41.17,50.27 43.18,48.26 v43.18,37.47
  Bottom 0.203: R19.2 44.11,37.5 44.07,37.47
  Bottom 0.254: X1.3 74.09,28.78 66.04,36.83 45.72,36.83 45.09,37.47 44.07,37.47 v43.18,37.47
  Bottom 0.305: U1.23 37.88,52.42 39.24,51.05 v39.24,50.27
SDIN
  Bottom 0.305: X1.40 28.46,26.15 29.84,24.77 31.74,24.77 32.37,25.4 32.37,26.72 33.06,27.41 34.01,27.41 34.91,28.31 34.91,29.26 34.92,29.28 34.92,30.55 38.1,33.72 38.1,40.93 R3.1
SDOUT
  Bottom 0.305: X1.38 32.37,27.61 32.37,29.26 36.83,33.72 36.83,40.64 36.96,40.77 R4.1
TX
  Bottom 0.203: IC3.2 79.38,34.29
  Bottom 0.305: X1.8 70.47,27.61 77.9,27.61 79.38,29.08 79.38,34.29
XTI  (1 unrouted)
  Bottom 0.254: U1.25 39.18,52.77 40.77,51.18 44.58,51.18 47.12,48.64 47.12,45.08 49.02,43.18 | 49.02,43.18 49.02,41.91 | C3.2 51.9,43.18 49.02,43.18
XTO
  Bottom 0.254: U1.26 39.83,52.88 40.77,51.94 45.21,51.94 47.88,49.28 49.02,49.28 | 49.02,49.28 49.09,49.34 Q2.1 | C18.2 51.14,49.28 49.02,49.28

### Text on the board
tPlace: MIDI
bPlace: JLCJLCJLCJLCJLC